# EAGLE design decoupling (EAGLE 6.5.0)
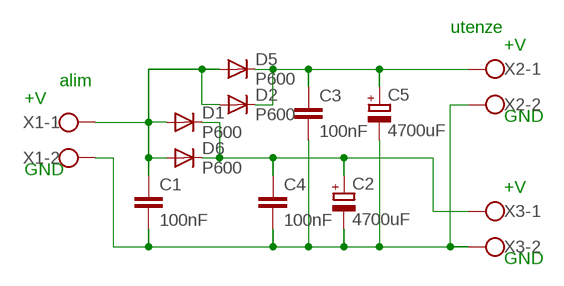
[diagram p0: schematic, sheet 1]

## Parts
C1  100nF  C-EU050-025X075  [C050-025X075]
C2  4700uF  CPOL-EUE7.5-16  [E7,5-16]
C3  100nF  C-EU050-025X075  [C050-025X075]
C4  100nF  C-EU050-025X075  [C050-025X075]
C5  4700uF  CPOL-EUE7.5-16  [E7,5-16]
D1  P600  [P6-15]
D2  P600  [P6-15]
D5  P600  [P6-15]
D6  P600  [P6-15]
X1  W237-102  [W237-102]
X2  W237-102  [W237-102]
X3  W237-102  [W237-102]

## Nets
N$3: C1.2 C2.- C3.2 C4.2 C5.- X1.2 X2.2 X3.2
N$4: C1.1 D1.A D2.A D5.A D6.A X1.1
N$5: C2.+ C4.1 D1.C D6.C X3.1
N$7: C3.1 C5.+ D2.C D5.C X2.1

## Notes on the sheet
- utenze
- +V
- alim
- +V
- GND
- GND
- +V
- GND

## Library data of the parts
C1 C3 C4 = rcl:C-EU: CAPACITOR, European symbol
C2 C5 = resistor:CPOL-EU: POLARIZED CAPACITOR, European symbol
D1 D2 D5 D6 = diode:P600: DIODE high voltage diode, silicon rectifier 1.0 A to 6.0 A, 50 V to 1300 V http://www.kosemi.com/product/diosr.html
X1-X3 = con-wago-500:W237-102: WAGO SCREW CLAMP; MPN: 237-102; OC_FARNELL: unknown; OC_NEWARK: 70K9898

## Board
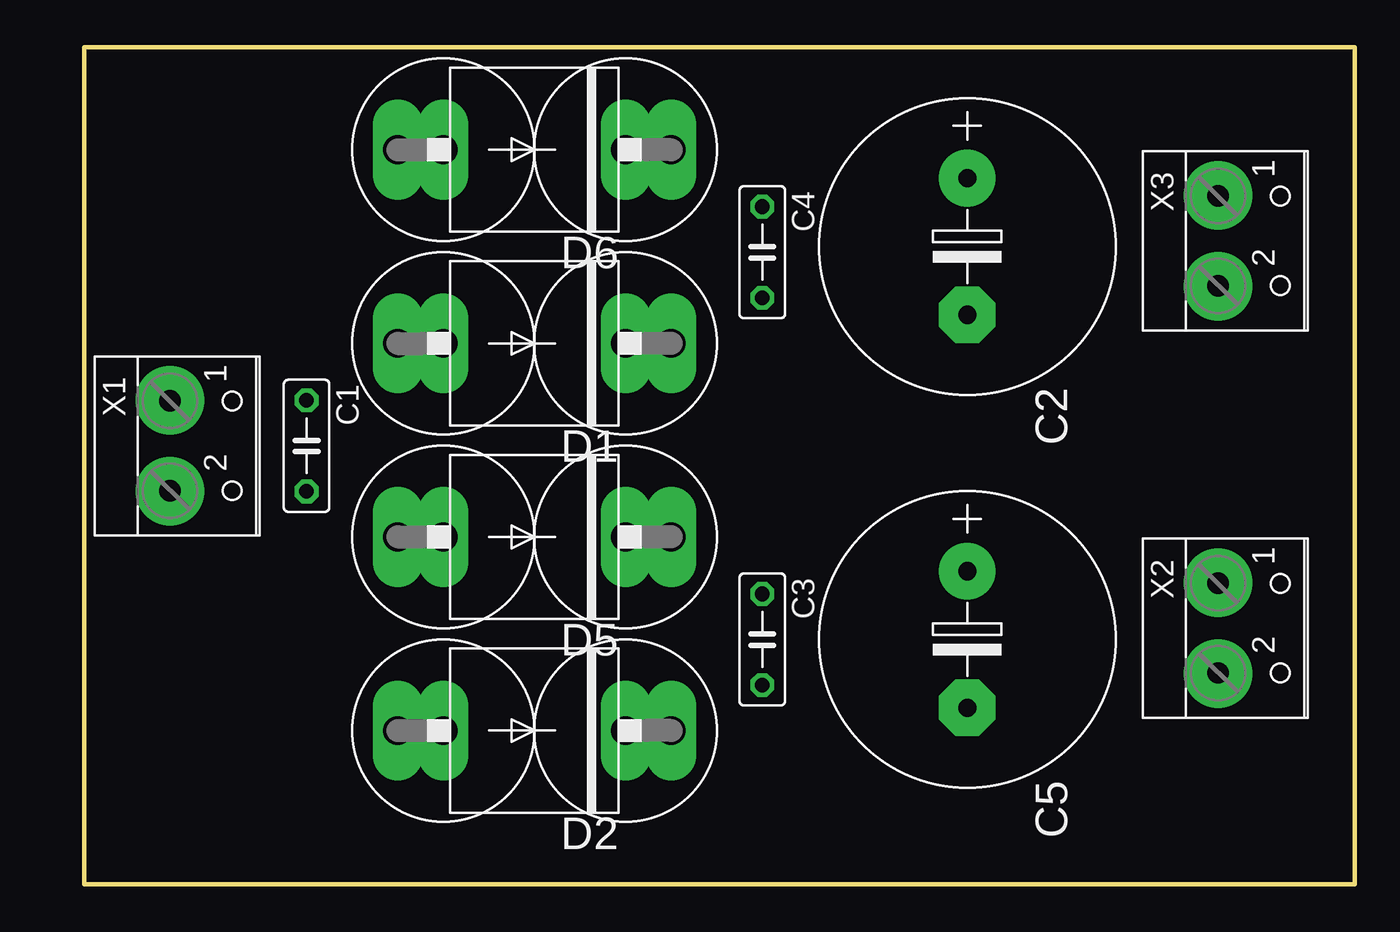
[diagram p1: board, top side]
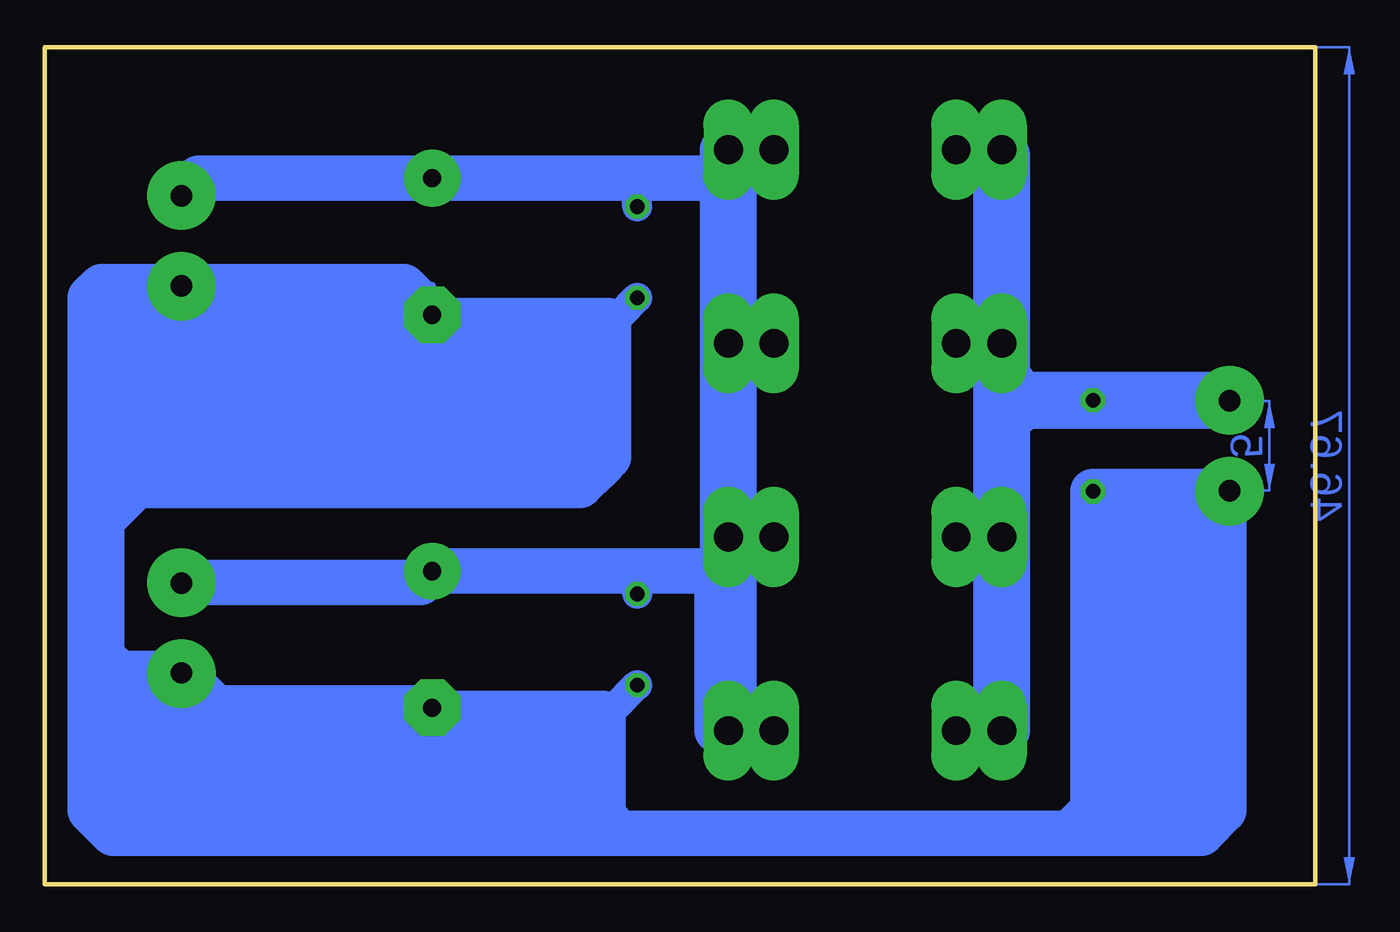
[diagram p2: board, bottom side, seen from below]

Size 70.8 x 46.67 mm. Coordinates in mm from the lower left corner, seen from the top.
Outline: 0,0 70.8,0 70.8,46.67 0,46.67 0,0
Copper layers (1*16): Top 0.035mm / dielectric 1.5mm / Bottom 0.035mm
Design rules "default": minimum track width 10mil, minimum drill 24mil, track to track 8mil, track to pad 8mil, pad to pad 8mil, via to via 8mil, smd to smd 8mil, copper to edge 40mil, drill to drill 8mil, minimum pad ring 10mil, minimum via ring 8mil, stop-mask expansion 4mil, vias tented up to drill 0mil, thermal gap 10mil

### Footprints (pad centres in the part's own frame; a part is rotated, then mirrored left to right if it is on the bottom)
C050-025X075 = drill 0.813 octagon: 1 -2.54,0; 2 2.54,0
E7,5-16 = drill 1.016 pad 3.15: + -3.81,0 | drill 1.016 pad 3.15 octagon: - 3.81,0
P6-15 = drill 1.6 pad 2.794 long: A 7.62,0; A1 5.08,0; C -7.62,0; C1 -5.08,0
W237-102 = drill 1.194 long: 1 -2.5,-1.27; 2 2.5,-1.27

### Placement (x,y rotation side)
C1  12.38,24.45 270 top
C2  49.21,35.56 270 top
C3  37.78,13.65 270 top
C4  37.78,35.24 270 top
C5  49.21,13.65 270 top
D1  25.08,30.16 180 top
D2  25.08,8.57 180 top
D5  25.08,19.37 180 top
D6  25.08,40.96 180 top
X1  6.03,24.45 270 top
X2  64.45,14.29 270 top
X3  64.45,35.88 270 top

### Tracks (layer width: path | path; a pad name or v marks a point on that pad's centre or on a via)
N$3  (via drill 0.6 pad 3.81)
  Bottom 0.406: v4.76,21.91 X1.2 | 13.34,2.86 47.62,2.86 | 48.9,9.84 C5.- 63.18,9.84 63.18,11.75 X2.2 67.67,11.79 68.26,12.38 | 48.9,31.75 C2.- 49.21,33.38 X3.2 63.22,33.34 66.68,33.34
  Bottom 1.676: C3.2 39.05,9.84 48.9,9.84 | C4.2 38.73,31.75 48.9,31.75 | 66.68,33.34 67.94,32.07 | 66.36,11.75 66.68,11.75 67.63,12.7 | 49.21,8.26 50.48,9.52
  Bottom 2.54: v4.76,21.91 C1.2 12.38,2.86 | 38.73,2.86 47.62,2.86 | 47.62,2.86 49.21,2.86 | 49.21,2.86 49.21,8.26 C5.- 61.28,9.84 63.18,11.75 66.36,11.75 67.63,11.75 68.26,12.38 | 68.26,12.38 68.26,32.7 67.63,33.34 66.68,33.34 | C2.- 50.8,33.34 56.2,33.34 61.91,33.34 66.68,33.34 | 5.08,21.59 5.08,4.13 6.35,2.86 13.34,2.86 | 13.34,2.86 13.34,3.18 12.7,3.81 11.75,3.81 11.11,3.18 11.11,20.64 7.94,20.64 6.98,19.68 6.98,5.08 7.3,4.76 9.21,4.76 | 9.21,4.76 9.52,4.44 9.52,18.42 8.89,19.05 8.89,5.08 9.21,4.76 | 9.21,4.76 11.43,4.76 13.34,2.86 | 13.34,2.86 38.73,2.86 | 38.73,2.86 39.69,3.81 39.69,9.52 48.58,9.52 48.58,6.35 46.99,4.76 41.91,4.76 41.59,4.44 41.59,7.3 41.27,7.62 47.31,7.62 47.62,7.3 46.67,6.35 43.5,6.35 43.18,6.03 44.45,6.03 47.62,2.86 | 49.21,2.86 66.99,2.86 68.26,4.13 68.26,11.75 | 68.26,12.38 68.26,11.75 | 68.26,11.75 66.04,9.52 63.82,9.52 62.55,8.26 51.43,8.26 50.8,7.62 50.8,5.71 51.43,5.08 51.12,4.76 66.68,4.76 66.99,4.44 66.99,7.3 66.68,7.62 52.71,7.62 51.75,6.67 52.39,6.03 66.36,6.03 66.36,10.48 67.31,11.43 67.63,11.43 | 67.63,12.38 67.63,11.43 | 67.63,11.43 66.04,9.84 66.04,11.11 67.63,12.7 67.63,20.32 | 67.63,29.21 67.63,32.39 66.68,33.34 | 39.69,31.43 39.69,23.49 | 39.69,23.49 40.01,23.18 | 40.01,23.18 40.96,22.22 65.72,22.22 67.63,20.32 | 67.63,20.32 67.63,29.21 | 67.63,29.21 66.04,30.8 66.04,31.11 51.12,31.11 50.8,30.8 42.23,30.8 41.59,30.16 41.59,24.76 42.23,24.13 65.41,24.13 65.72,23.81 65.72,28.26 65.09,28.89 43.82,28.89 43.5,28.58 43.5,26.04 64.45,26.04 65.41,25.08 65.41,26.99 45.4,26.99 44.77,27.62 | 39.69,31.43 39.37,31.43 | 39.37,31.43 39.37,23.81 39.69,23.49
  Bottom 2.54: 40.01,23.18 40.01,30.8 39.37,31.43 | 39.69,31.43 52.07,31.43
N$4  (via drill 0.6 pad 3.81)
  Bottom 0.406: X1.1 12.38,26.95 C1.1 | D1.A 17.46,26.99 D5.A
  Bottom 1.676: 15.88,26.99 16.83,27.94 | 16.51,26.35 16.83,26.04
  Bottom 2.54: 5.08,26.99 v4.76,26.99 5.08,27.31 16.19,27.31 16.51,26.99 | 5.08,26.99 C1.1 | C1.1 15.56,26.99 | 15.56,26.99 15.88,26.99 | 15.88,26.99 16.51,26.99 | 16.51,26.99 17.46,26.99 D6.A | D6.A D5.A | D5.A D2.A | D2.A 17.78,8.57 | 17.78,8.57 20,8.57 | D5.A 20,19.37 | D6.A 20,40.96 | v63.18,16.83 49.85,16.83 49.21,17.46 33.02,17.46 | 16.51,26.99 16.51,26.67 5.4,26.67 5.08,26.99 | C1.1 15.56,26.99 | 15.88,26.99 16.51,26.35 16.83,26.35 17.14,26.04 17.14,8.57 D2.A | 17.78,8.57 17.78,40.01 17.14,40.64 17.14,29.21 17.14,28.26 | 17.14,28.26 17.14,27.62 16.83,27.31 | 17.14,28.26 16.83,27.94
  other vias: 63.18,38.42 63.18,33.34 63.18,11.75
N$5
  Bottom 0.406: 62.23,39.37 63.18,39.37 63.18,38.42 X3.1 | C2.+ 48.9,39.05 39.05,39.05 C4.1 37.15,39.05 33.97,39.05 33.34,37.78 | 33.34,37.78 32.7,38.42 32.7,39.37 32.7,40.32 | 33.34,37.78 33.34,30.8 D1.C
  Bottom 1.676: C4.1 37.78,38.42
  Bottom 2.54: D1.C 30.16,30.16 | 32.7,40.32 D6.C | D6.C 31.12,40.96 30.16,40.96 | 32.7,39.37 C2.+ 62.23,39.37 63.18,38.42 | D6.C 33.02,40.96 33.02,18.1 33.34,17.78 33.34,8.89 | 33.34,8.57 33.34,8.89 | 33.34,8.89 32.38,9.84 32.38,39.69 32.07,40.01
N$7
  Bottom 0.406: X2.1 49.21,16.79 C5.+ 37.78,17.46 37.78,17.15 33.02,17.46 | 33.02,17.46 32.07,20 32.7,20 D5.C | 33.02,17.46 32.7,16.19 D2.C
  Bottom 1.676: C3.1 37.78,17.15 | 32.7,37.47 32.7,37.78 33.65,38.73
  Bottom 2.54: D5.C 30.16,19.37 | 30.16,8.57 D2.C 32.7,37.47 32.7,40.96
N$9
  Bottom 2.54: 18.1,30.16 20,30.16
N$10
  Bottom 1.676: 34.93,39.69 33.97,39.69 33.34,40.32
(copper drawn outside any net)
  shapes: Bottom area x2